# Altium project ESP32S3_NRF52_Tag.PrjPcb
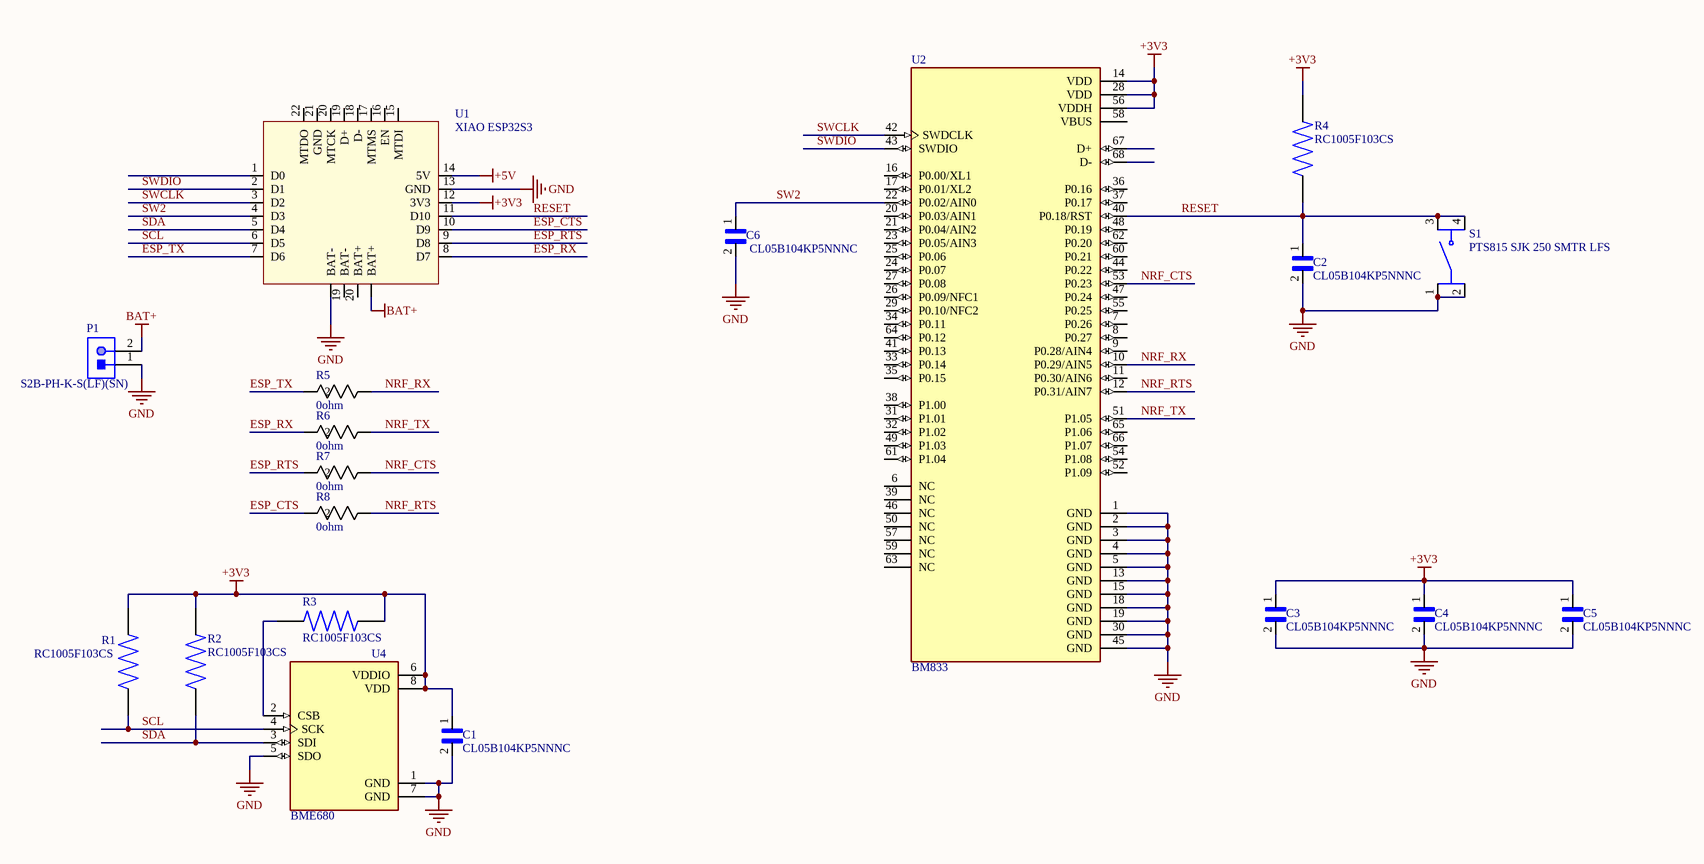
[diagram p0: Tag.SchDoc]
1 sheet, 19 parts. Net scope: global (net labels, ports and power ports of the same name join across sheets).
Board file: Tag.PcbDoc

## Sheet Tag.SchDoc
size A3; SheetNumber: 1; SheetTotal: 1

### Parts
C1  CL05B104KP5NNNC  [CAPC1005X55N]
C2  CL05B104KP5NNNC  [CAPC1005X55N]
C3  CL05B104KP5NNNC  [CAPC1005X55N]
C4  CL05B104KP5NNNC  [CAPC1005X55N]
C5  CL05B104KP5NNNC  [CAPC1005X55N]
C6  CL05B104KP5NNNC  [CAPC1005X55N]
P1  S2B-PH-K-S(LF)(SN)  [JST-S2B-PH-K-S_V]
R1  RC1005F103CS  [RESC1005X40N]
R2  RC1005F103CS  [RESC1005X40N]
R3  RC1005F103CS  [RESC1005X40N]
R4  RC1005F103CS  [RESC1005X40N]
R5  0ohm  [RC0402N_YAG]
R6  0ohm  [RC0402N_YAG]
R7  0ohm  [RC0402N_YAG]
R8  0ohm  [RC0402N_YAG]
S1  PTS815 SJK 250 SMTR LFS  [SWITCH_SMTR LFS]
U1  XIAO ESP32S3  [XIAO_ESP32S3]
U2  BM833  [XCVR_BM833]
U4  BME680  [PSON80P300X300X100-8N]

### Nets
+3V3: C1.1 C3.1 C4.1 C5.1 R1.2 R2.2 R3.1 R4.1 U1.12(3V3) U2.14(VDD) U2.28(VDD) U2.56(VDDH) U4.6(VDDIO) U4.8(VDD)
+5V: U1.14(5V)
BAT+: P1.2 U1.BAT+
GND: C1.2 C2.2 C3.2 C4.2 C5.2 C6.2 P1.1 S1.1 S1.2 U1.13(GND) U1.BAT- U2.1(GND) U2.2(GND) U2.3(GND) U2.4(GND) U2.5(GND) U2.13(GND) U2.15(GND) U2.18(GND) U2.19(GND) U2.30(GND) U2.45(GND) U4.1(GND) U4.5(SDO) U4.7(GND)
ESP_CTS: R8.2 U1.10(D9)
ESP_RTS: R7.2 U1.9(D8)
ESP_RX: R6.2 U1.8(D7)
ESP_TX: R5.2 U1.7(D6)
NRF_CTS: R7.1 U2.53(P0.23)
NRF_RTS: R8.1 U2.12(P0.31/AIN7)
NRF_RX: R5.1 U2.10(P0.29/AIN5)
NRF_TX: R6.1 U2.51(P1.05)
RESET: C2.1 R4.2 S1.3 S1.4 U1.11(D10) U2.40(P0.18/RST)
SCL: R1.1 U1.6(D5) U4.4(SCK)
SDA: R2.1 U1.5(D4) U4.3(SDI)
SW2: C6.1 U1.4(D3) U2.22(P0.02/AIN0)
SWCLK: U1.3(D2) U2.42(SWDCLK)
SWDIO: U1.2(D1) U2.43(SWDIO)
NetR3_2: R3.2 U4.2(CSB)

Not connected (* = marked no-connect by the designer): U1 1(D0) 15(MTDI) 16(EN) 17(MTMS) 18(D-) 19(BAT-) 20(BAT+) 21(GND) 22(MTDO); U2 6(NC) 7(P0.26) 8(P0.27) 9(P0.28/AIN4) 11(P0.30/AIN6) 16(P0.00/XL1) 17(P0.01/XL2) 20(P0.03/AIN1) 21(P0.04/AIN2) 23(P0.05/AIN3) 24(P0.07) 25(P0.06) 26(P0.09/NFC1) 27(P0.08) 29(P0.10/NFC2) 31(P1.01) 32(P1.02) 33(P0.14) 34(P0.11) 35(P0.15) 36(P0.16) 37(P0.17) 38(P1.00) 39(NC) 41(P0.13) 44(P0.22) 46(NC) 47(P0.24) 48(P0.19) 49(P1.03) 50(NC) 52(P1.09) 54(P1.08) 55(P0.25) 57(NC) 58(VBUS) 59(NC) 60(P0.21) 61(P1.04) 62(P0.20) 63(NC) 64(P0.12) 65(P1.06) 66(P1.07) 67(D+) 68(D-)

### Library data of the parts
C1-C6 = CL05B104KP5NNNC: 0.1ÂµF Â±10% 10V Ceramic Capacitor X7R 0402 _1005 Metric_; MF: Samsung Electro-Mechanics; MP: CL05B104KP5NNNC; Availability: Unavailable; SnapEDA_Link: https://www.snapeda.com/parts/CL05B104KP5NNNC/Samsung%20Electro-Mechanics/view-part/1365387/?ref=snap; Package: 0402 Samsung; Price: None; Value: *
P1 = CMP-1755-00004-1: Male Header, Pitch 2 mm, 1 x 2 Position, Height 4.8 mm, Tail Length 3.4 mm, -25 to 85 degC, RoHS, Bulk; Case\Package: Radial; Tolerance: 20%; Capacitance: 10 uF; Voltage Rating (DC): 50 V; Packaging: Bulk; ComponentLink1URL: http://www.jst-mfg.com/product/pdf/eng/ePH.pdf; Radiation Hardening: No; Height: 11 mm; Package Quantity: 200; PackageDescription: Male Header, Pitch 2 mm, 1 x 2 Position, Height 4.8 mm, Tail Length 3.4 mm; PackageReference: S2B-PH-K-S; Diameter: 5 mm; Pins: 2; Mount: Through Hole; Max Operating Temperature: 85 degC; Min Operating Temperature: -40 degC; ComponentLink1Description: Datasheet; DatasheetVersion: Dec-12; Length: 11 mm; Lead Pitch: 2 mm; REACH SVHC: No SVHC; Voltage Rating: 50 V; RoHSCompliant: true
R1-R4 = RC1005F103CS: 10 kOhms Â±1% 0.063W, 1/16W Chip Resistor 0402 (1005 Metric) Moisture Resistant Thick Film; MF: Samsung Electro-Mechanics; Value: *; Check_prices: https://www.snapeda.com/parts/RC1005F103CS/Samsung+Electro-Mechanics/view-part/?ref=eda; SnapEDA_Link: https://www.snapeda.com/parts/RC1005F103CS/Samsung+Electro-Mechanics/view-part/?ref=snap; Availability: In Stock; MP: RC1005F103CS; Purchase-URL: https://pricing.snapeda.com/search/part/RC1005F103CS/?ref=eda; Package: 1005 Panasonic Electronic Components; Price: None
R5-R8 = RC0402JR-070RL: No Description Available; Mfr_Name: Yageo
S1 = PTS815 SJK 250 SMTR LFS: No Description Available; Mfr_Name: C&K Components; RefDes: RefDes; Type: Type
U1 = XIAO_ESP32S3
U2 = BM833: 802.15.4, Bluetooth Bluetooth v5.1 Transceiver Module 2.4GHz PCB Trace Surface Mount; MF: Fanstel; Package: None; Availability: In Stock; Purchase-URL: https://pricing.snapeda.com/search/part/BM833/?ref=eda; Value: *; MP: BM833; SnapEDA_Link: https://www.snapeda.com/parts/BM833/Fanstel/view-part/?ref=snap; Price: None; Check_prices: https://www.snapeda.com/parts/BM833/Fanstel/view-part/?ref=eda
U4 = BME680: Gas, Humidity, Pressure, Temperature Sensor IÂ²C, SPI Output; MF: Bosch Sensortec; Check_prices: https://www.snapeda.com/parts/BME680/Bosch+Sensortec/view-part/?ref=eda; Value: *; Availability: In Stock; MP: BME680; Price: None; Package: LGA-8 Bosch Tools; SnapEDA_Link: https://www.snapeda.com/parts/BME680/Bosch+Sensortec/view-part/?ref=snap; Purchase-URL: https://pricing.snapeda.com/search/part/BME680/?ref=eda